# EAGLE design digit_led_controler (EAGLE 6.5.0)
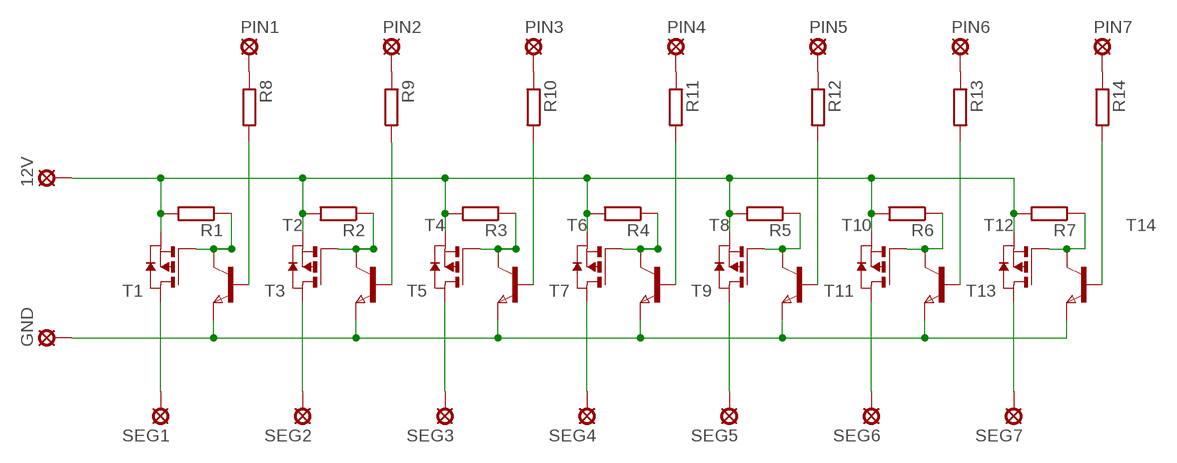
[diagram p0: schematic, sheet 1]

## Parts
12V  SE14  [SE14]
GND  SE14  [SE14]
PIN1  SE14  [SE14]
PIN2  SE14  [SE14]
PIN3  SE14  [SE14]
PIN4  SE14  [SE14]
PIN5  SE14  [SE14]
PIN6  SE14  [SE14]
PIN7  SE14  [SE14]
R1  R-EU_R0805  [R0805]
R2  R-EU_R0805  [R0805]
R3  R-EU_R0805  [R0805]
R4  R-EU_R0805  [R0805]
R5  R-EU_R0805  [R0805]
R6  R-EU_R0805  [R0805]
R7  R-EU_R0805  [R0805]
R8  R-EU_R0805  [R0805]
R9  R-EU_R0805  [R0805]
R10  R-EU_R0805  [R0805]
R11  R-EU_R0805  [R0805]
R12  R-EU_R0805  [R0805]
R13  R-EU_R0805  [R0805]
R14  R-EU_R0805  [R0805]
SEG1  SE14  [SE14]
SEG2  SE14  [SE14]
SEG3  SE14  [SE14]
SEG4  SE14  [SE14]
SEG5  SE14  [SE14]
SEG6  SE14  [SE14]
SEG7  SE14  [SE14]
T1  PMOSSOT23  [SOT-23]
T2  NPNSOT23  [SOT-23]
T3  PMOSSOT23  [SOT-23]
T4  NPNSOT23  [SOT-23]
T5  PMOSSOT23  [SOT-23]
T6  NPNSOT23  [SOT-23]
T7  PMOSSOT23  [SOT-23]
T8  NPNSOT23  [SOT-23]
T9  PMOSSOT23  [SOT-23]
T10  NPNSOT23  [SOT-23]
T11  PMOSSOT23  [SOT-23]
T12  NPNSOT23  [SOT-23]
T13  PMOSSOT23  [SOT-23]
T14  NPNSOT23  [SOT-23]

## Nets
N$1: PIN1.MP R8.1
N$2: R1.1 T1.3(G) T2.1(C)
N$3: GND.MP T2.2(E) T4.2(E) T6.2(E) T8.2(E) T10.2(E) T12.2(E) T14.2(E)
N$4: SEG1.MP T1.1(D)
N$5: R2.1 T3.3(G) T4.1(C)
N$6: 12V.MP R1.2 R2.2 R3.2 R4.2 R5.2 R6.2 R7.2 T1.2(S) T3.2(S) T5.2(S) T7.2(S) T9.2(S) T11.2(S) T13.2(S)
N$7: PIN2.MP R9.1
N$8: PIN3.MP R10.1
N$9: PIN4.MP R11.1
N$10: SEG2.MP T3.1(D)
N$11: PIN5.MP R12.1
N$12: PIN6.MP R13.1
N$13: R3.1 T5.3(G) T6.1(C)
N$14: PIN7.MP R14.1
N$15: R8.2 T2.3(B)
N$16: R9.2 T4.3(B)
N$17: SEG3.MP T5.1(D)
N$18: R10.2 T6.3(B)
N$19: R11.2 T8.3(B)
N$20: R12.2 T10.3(B)
N$21: R13.2 T12.3(B)
N$22: R4.1 T7.3(G) T8.1(C)
N$23: R14.2 T14.3(B)
N$26: SEG4.MP T7.1(D)
N$33: R5.1 T9.3(G) T10.1(C)
N$37: SEG5.MP T9.1(D)
N$46: R6.1 T11.3(G) T12.1(C)
N$50: SEG6.MP T11.1(D)
N$61: R7.1 T13.3(G) T14.1(C)
N$65: SEG7.MP T13.1(D)

## Library data of the parts
12V GND PIN1-PIN7 SEG1-SEG7 = solpad:SE14: SOLDER PAD E1553, drill 1,4mm, distributor Buerklin, 07F820
R1-R14 = resistor:R-EU_: RESISTOR, European symbol
T1 T3 T5 T7 T9 T11 T13 = zetex:PMOSSOT23: MOS FET; OC_FARNELL: unknown; OC_NEWARK: unknown
T2 T4 T6 T8 T10 T12 T14 = zetex:NPNSOT23: NPN TRANSISTOR; MPN: DSS20201L-7; OC_FARNELL: 1710688; OC_NEWARK: 25R4555

## Board
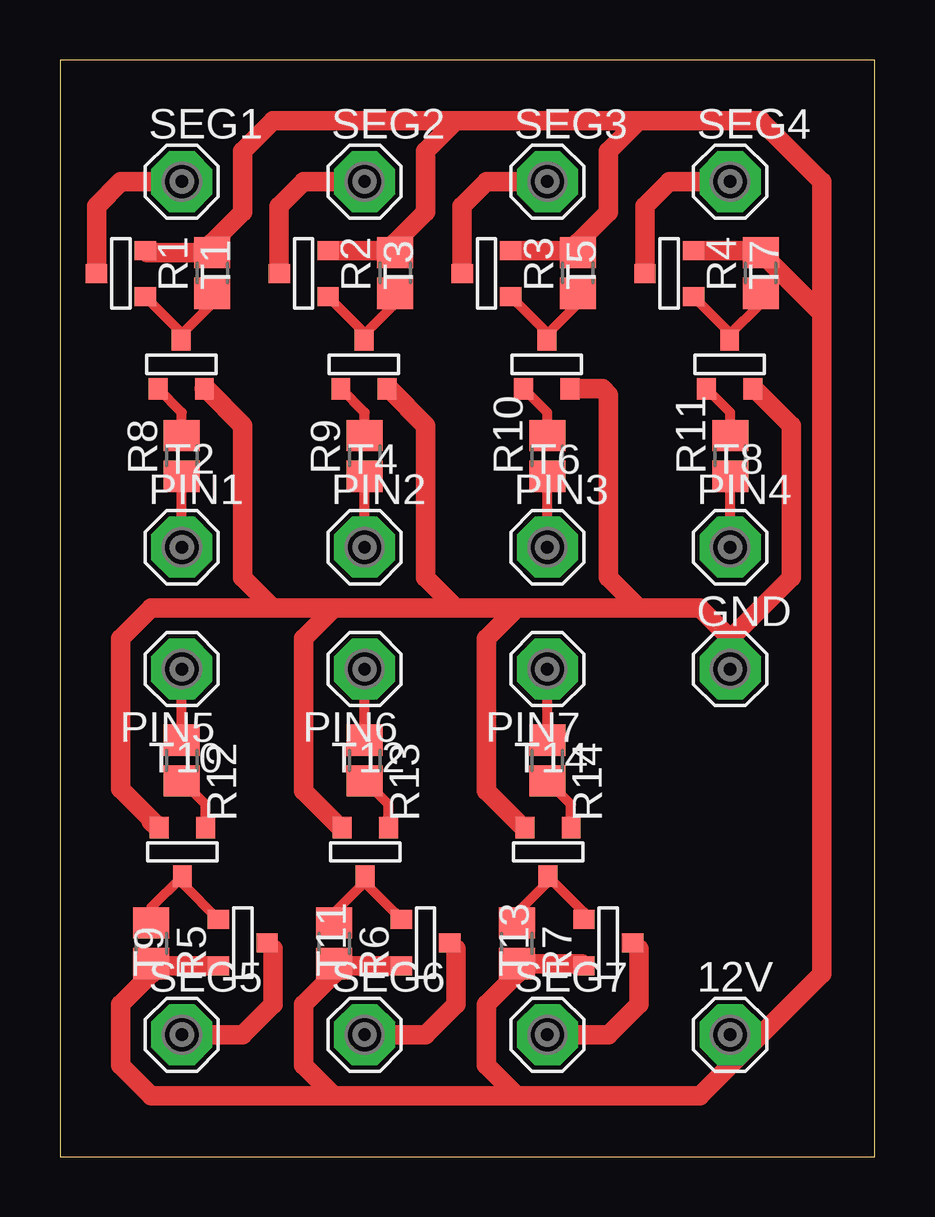
[diagram p1: board, top side]

Size 33.96 x 45.71 mm. Coordinates in mm from the lower left corner, seen from the top.
Outline: 0,0 33.96,0 33.96,45.71 0,45.71 0,0
Copper layers (1*16): Top 0.035mm / dielectric 1.5mm / Bottom 0.035mm
Design rules "default": minimum track width 10mil, minimum drill 24mil, track to track 8mil, track to pad 8mil, pad to pad 8mil, via to via 8mil, smd to smd 8mil, copper to edge 40mil, drill to drill 8mil, minimum pad ring 10mil, minimum via ring 8mil, stop-mask expansion 4mil, vias tented up to drill 0mil, thermal gap 10mil

### Footprints (pad centres in the part's own frame; a part is rotated, then mirrored left to right if it is on the bottom)
SE14 = drill 1.397 pad 2.54 octagon: MP 0,0
R0805 = smd 1.3 x 1.5: 1 -0.85,0; 2 0.85,0
SOT-23 = smd 0.787 x 0.889: 1 0.025,-1.016; 2 -0.94,1.016; 3 0.991,1.016

### Placement (x,y rotation side)
12V  27.94,5.08 0 top
GND  27.94,20.32 0 top
PIN1  5.08,25.4 0 top
PIN2  12.7,25.4 0 top
PIN3  20.32,25.4 0 top
PIN4  27.94,25.4 0 top
PIN5  5.08,20.32 180 top
PIN6  12.7,20.32 180 top
PIN7  20.32,20.32 180 top
R1  6.35,36.83 90 top
R2  13.97,36.83 90 top
R3  21.59,36.83 90 top
R4  29.21,36.83 90 top
R5  3.81,8.89 270 top
R6  11.43,8.89 270 top
R7  19.05,8.89 270 top
R8  5.08,29.21 90 top
R9  12.7,29.21 90 top
R10  20.32,29.21 90 top
R11  27.94,29.21 90 top
R12  5.08,16.51 270 top
R13  12.7,16.51 270 top
R14  20.32,16.51 270 top
SEG1  5.08,40.64 0 top
SEG2  12.7,40.64 0 top
SEG3  20.32,40.64 0 top
SEG4  27.94,40.64 0 top
SEG5  5.08,5.08 0 top
SEG6  12.7,5.08 0 top
SEG7  20.32,5.08 0 top
T1  2.54,36.83 270 top
T2  5.08,33.02 180 top
T3  10.16,36.83 270 top
T4  12.7,33.02 180 top
T5  17.78,36.83 270 top
T6  20.32,33.02 180 top
T7  25.4,36.83 270 top
T8  27.94,33.02 180 top
T9  7.62,8.89 90 top
T10  5.08,12.7 0 top
T11  15.24,8.89 90 top
T12  12.7,12.7 0 top
T13  22.86,8.89 90 top
T14  20.32,12.7 0 top

### Tracks (layer width: path | path; a pad name or v marks a point on that pad's centre or on a via)
N$1
  Top 0.406: PIN1.MP R8.1
N$2
  Top 0.406: T2.1 5.05,34.34 | 5.05,34.34 T1.3 | 5.05,34.34 5.13,34.34 6.35,35.56 R1.1
N$3
  Top 0.813: 3.81,13.97 4.06,13.72 T10.2 2.54,15.32 2.54,21.59 3.81,22.86 8.89,22.86 | GND.MP 27.94,21.59 | 27.94,21.59 26.67,22.86 24.13,22.86 | 24.13,22.86 19.05,22.86 | 19.05,22.86 16.51,22.86 | 16.51,22.86 11.43,22.86 | 11.43,22.86 8.89,22.86 | T12.2 11.68,13.72 10.16,15.24 10.16,21.59 11.43,22.86 | T14.2 19.3,13.72 17.78,15.24 17.78,21.59 19.05,22.86 | T8.2 28.96,32 30.48,30.48 30.48,24.13 27.94,21.59 | T6.2 22.61,32 22.86,31.75 22.86,24.13 24.13,22.86 | T4.2 13.72,32 15.24,30.48 15.24,24.13 16.51,22.86 | T2.2 6.1,32 7.62,30.48 7.62,24.13 8.89,22.86
N$4
  Top 0.813: T1.1 1.52,39.62 2.54,40.64 SEG1.MP
N$5
  Top 0.406: T4.1 12.68,34.34 | 12.68,34.34 T3.3 | 12.68,34.34 12.75,34.34 13.97,35.56 R2.1
N$6
  Top 0.813: T13.2 21.75,8.04 R7.2 19.05,7.62 17.78,6.35 17.78,3.81 19.05,2.54 | T5.2 21.5,37.77 R3.2 21.59,38.1 22.86,39.37 22.86,41.91 24.13,43.18 | T3.2 13.88,37.77 R2.2 13.97,38.1 15.24,39.37 15.24,41.91 16.51,43.18 | T1.2 3.65,37.68 R1.2 6.35,38.1 7.62,39.37 7.62,41.91 8.89,43.18 16.51,43.18 | T11.2 11.52,7.95 R6.2 11.43,7.62 10.16,6.35 10.16,3.81 11.43,2.54 | T9.2 3.9,7.95 R5.2 3.81,7.62 2.54,6.35 2.54,3.81 3.81,2.54 11.43,2.54 | 12V.MP 27.94,3.81 | 27.94,3.81 26.67,2.54 19.05,2.54 | 19.05,2.54 11.43,2.54 | 27.94,3.81 31.75,7.62 31.75,33.02 31.75,35.14 | 29.54,37.77 T7.2 29.12,37.77 R4.2 31.75,35.14 | 16.51,43.18 24.13,43.18 | 24.13,43.18 29.21,43.18 31.75,40.64 31.75,35.14
N$7
  Top 0.406: PIN2.MP R9.1
N$8
  Top 0.406: PIN3.MP R10.1
N$9
  Top 0.406: PIN4.MP R11.1
N$10
  Top 0.813: T3.1 9.14,39.62 10.16,40.64 SEG2.MP
N$11
  Top 0.406: R12.1 PIN5.MP
N$12
  Top 0.406: R13.1 PIN6.MP
N$13
  Top 0.406: R3.1 21.59,35.56 20.3,34.27 T6.1 20.3,34.34 T5.3
N$14
  Top 0.406: R14.1 PIN7.MP
N$15
  Top 0.406: R8.2 5.08,31.01 T2.3
N$16
  Top 0.406: R9.2 12.7,31.01 T4.3
N$17
  Top 0.813: T5.1 16.76,39.62 17.78,40.64 SEG3.MP
N$18
  Top 0.406: R10.2 20.32,31.01 T6.3
N$19
  Top 0.406: R11.2 27.94,31.01 T8.3
N$20
  Top 0.406: T10.3 6.07,14.67 R12.2
N$21
  Top 0.406: T12.3 13.69,14.67 R13.2
N$22
  Top 0.406: R4.1 29.21,35.56 27.91,34.27 T8.1 27.91,34.34 T7.3
N$23
  Top 0.406: T14.3 21.31,14.67 R14.2
N$26
  Top 0.813: T7.1 24.38,39.62 25.4,40.64 SEG4.MP
N$33
  Top 0.406: R5.1 3.81,10.39 T10.1 5.11,11.38 T9.3
N$37
  Top 0.813: SEG5.MP 7.62,5.08 8.89,6.35 8.89,8.66 T9.1
N$46
  Top 0.406: R6.1 11.43,10.16 12.72,11.46 T12.1 12.72,11.4 13.97,10.16 13.97,10.13 T11.3
N$50
  Top 0.813: SEG6.MP 15.24,5.08 16.51,6.35 16.51,8.66 T11.1
N$61
  Top 0.406: R7.1 19.05,10.16 20.34,11.46 T14.1 21.84,10.19 T13.3
N$65
  Top 0.813: SEG7.MP 22.86,5.08 24.13,6.35 24.13,8.66 T13.1